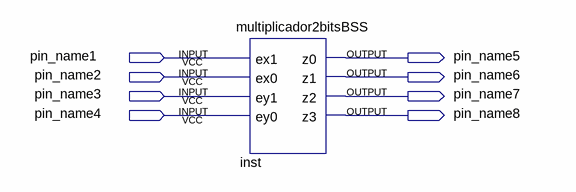
[diagram p0: schematic sheet]
// Quartus schematic top.bdf as structural Verilog: 1 symbols, 8 pins
module top (
  input  pin_name1,
  input  pin_name2,
  input  pin_name3,
  input  pin_name4,
  output pin_name5,
  output pin_name6,
  output pin_name7,
  output pin_name8
);

  multiplicador2bitsBSS inst (
    .ex1(pin_name1), .ex0(pin_name2), .ey1(pin_name3), .ey0(pin_name4), .z0(pin_name5), .z1(pin_name6),
    .z2(pin_name7), .z3(pin_name8));
endmodule
